# EAGLE design Anode top (EAGLE 5.11)
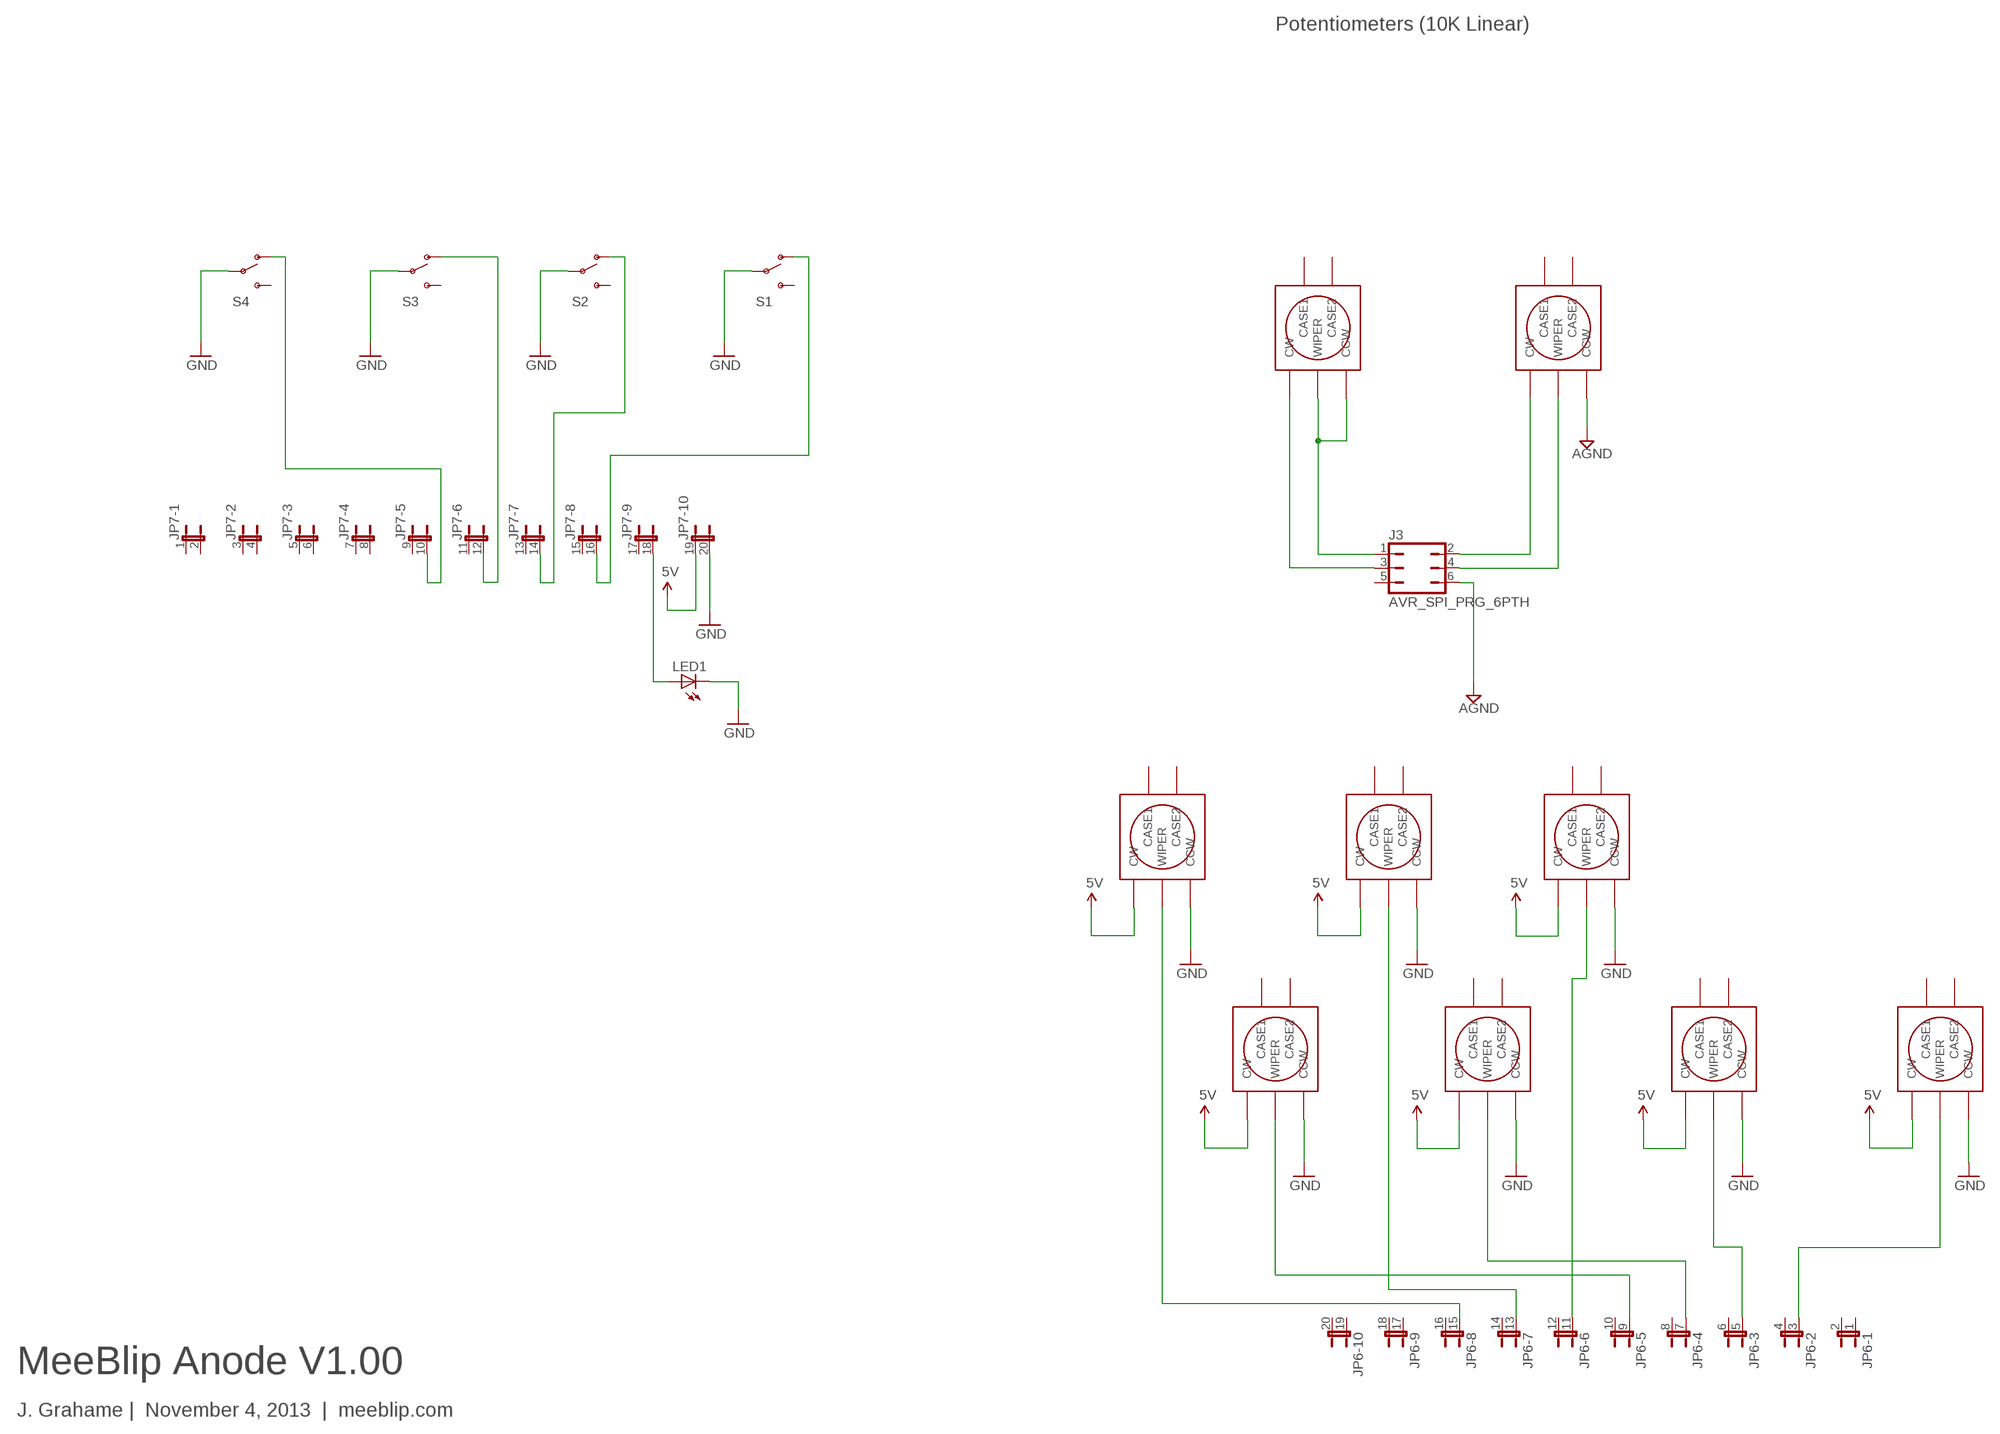
[diagram p0: schematic, sheet 1]

## Parts
J3  AVR_SPI_PRG_6PTH  JP3Q  [JP3Q]
JP6  JP10QE  [JP10Q]
JP7  JP10QE  [JP10Q]
LED1  LED3MM  [LED3MM]
POT1  VACOLOCO_EVUFRK09_POT  [VACOLOCO_EVUF]
POT2  VACOLOCO_EVUFRK09_POT  [VACOLOCO_EVUF]
POT3  VACOLOCO_EVUFRK09_POT  [VACOLOCO_EVUF]
POT4  VACOLOCO_EVUFRK09_POT  [VACOLOCO_EVUF]
POT5  VACOLOCO_EVUFRK09_POT  [VACOLOCO_EVUF]
POT6  VACOLOCO_EVUFRK09_POT  [VACOLOCO_EVUF]
POT7  VACOLOCO_EVUFRK09_POT  [VACOLOCO_EVUF]
POT8  VACOLOCO_EVUFRK09_POT  [VACOLOCO_EVUF]
POT9  VACOLOCO_EVUFRK09_POT  [VACOLOCO_EVUF]
S1  SWITCH-SPSTPTH  [SWITCH-SPDT]
S2  SWITCH-SPSTPTH  [SWITCH-SPDT]
S3  SWITCH-SPSTPTH  [SWITCH-SPDT]
S4  SWITCH-SPSTPTH  [SWITCH-SPDT]

## Nets
5V: JP7.19 POT2.CW POT3.CW POT4.CW POT6.CW POT7.CW POT8.CW POT9.CW
AGND: J3.6 POT1.CCW
GND: JP7.20 LED1.K(C) POT2.CCW POT3.CCW POT4.CCW POT6.CCW POT7.CCW POT8.CCW POT9.CCW S1.2(P) S2.2(P) S3.2(P) S4.2(P)
N$1: J3.2 POT1.CW
N$2: JP7.18 LED1.A
N$3: JP6.15 POT2.WIPER
N$4: JP6.13 POT3.WIPER
N$5: JP7.16 S1.1(O)
N$6: JP7.14 S2.1(O)
N$7: JP6.11 POT4.WIPER
N$8: JP6.9 POT6.WIPER
N$9: JP6.7 POT7.WIPER
N$10: JP7.12 S3.1(O)
N$11: JP7.10 S4.1(O)
N$12: JP6.5 POT8.WIPER
N$13: JP6.3 POT9.WIPER
N$14: J3.4 POT1.WIPER
N$15: J3.1 POT5.CCW POT5.WIPER
N$16: J3.3 POT5.CW
Unconnected: J3.5 JP6.1 JP6.2 JP6.4 JP6.6 JP6.8 JP6.10 JP6.12 JP6.14 JP6.16 JP6.17 JP6.18 JP6.19 JP6.20 JP7.1 JP7.2 JP7.3 JP7.4 JP7.5 JP7.6 JP7.7 JP7.8 JP7.9 JP7.11 JP7.13 JP7.15 JP7.17 POT1.CASE1 POT1.CASE2 POT2.CASE1 POT2.CASE2 POT3.CASE1 POT3.CASE2 POT4.CASE1 POT4.CASE2 POT5.CASE1 POT5.CASE2 POT6.CASE1 POT6.CASE2 POT7.CASE1 POT7.CASE2 POT8.CASE1 POT8.CASE2 POT9.CASE1 POT9.CASE2 S1.3(S) S2.3(S) S3.3(S) S4.3(S)

## Notes on the sheet
- Potentiometers (10K Linear)
- MeeBlip Anode V1.00
- J. Grahame |  November 4, 2013  |  meeblip.com

## Library data of the parts
J3 = jumper:JP3Q: JUMPER
JP6 JP7 = jumper:JP10QE: JUMPER
LED1 = meeblip:LED: LED OSRAM: - CHIPLED LG R971, LG N971, LY N971, LG Q971, LY Q971, LO R971, LY R971 LH N974, LH R974 LS Q976, LO Q976, LY Q976 LO Q996 - Hyper CHIPLED LW Q18S LB Q993, LB Q99A, LB R99A - SideLED LS A670, LO A670, LY A670, LG A670, LP A670 LB A673, LV A673, LT A673, LW A673 LH A674 LY A675 LS A676, LA A676, LO A676, LY A676, LW A676 LS A679, LY A679, LG A679 - Hyper Micro SIDELED® LS Y876, LA Y876, LO Y876, LY Y876 LT Y87S - SmartLED LW L88C, LW L88S LB L89C, LB L89S, LG L890 LS L89K, LO L89K, LY L89K LS L896, LA L896, LO L896, LY L896 - TOPLED LS T670, LO T670, LY T670, LG T670, LP T670 LSG T670, LSP T670, LSY T670, LOP T670, LYG T670 LG T671, LOG T671, LSG T671 LB T673, LV T673, LT T673, LW T673 LH T674 LS T676, LA T676, LO T676, LY T676, LB T676, LH T676, LSB T676, LW T676 LB T67C, LV T67C, LT T67C, LS T67K, LO T67K, LY T67K, LW E67C LS E67B, LA E67B, LO E67B, LY E67B, LB E67C, LV E67C, LT E67C LW T67C LS T679, LY T679, LG T679 LS T770, LO T770, LY T770, LG T770, LP T770 LB T773, LV T773, LT T773, LW T773 LH T774 LS E675, LA E675, LY E675, LS T675 LS T776, LA T776, LO T776, LY T776, LB T776 LHGB T686 LT T68C, LB T68C - Hyper Mini TOPLED® LB M676 - Mini TOPLED Santana® LG M470 LS M47K, LO M47K, LY M47K Source: http://www.osram.convergy.de LUXEON: - LUMILED® LXK2-PW12-R00, LXK2-PW12-S00, LXK2-PW14-U00, LXK2-PW14-V00 LXK2-PM12-R00, LXK2-PM12-S00, LXK2-PM14-U00 LXK2-PE12-Q00, LXK2-PE12-R00, LXK2-PE12-S00, LXK2-PE14-T00, LXK2-PE14-U00 LXK2-PB12-K00, LXK2-PB12-L00, LXK2-PB12-M00, LXK2-PB14-N00, LXK2-PB14-P00, LXK2-PB14-Q00 LXK2-PR12-L00, LXK2-PR12-M00, LXK2-PR14-Q00, LXK2-PR14-R00 LXK2-PD12-Q00, LXK2-PD12-R00, LXK2-PD12-S00 LXK2-PH12-R00, LXK2-PH12-S00 LXK2-PL12-P00, LXK2-PL12-Q00, LXK2-PL12-R00 Source: www.luxeon.com KINGBRIGHT: KA-3528ASYC Source: www.kingbright.com
POT1-POT9 = meeblip-MOD:VACOLOCO_EVUF: Panasonic EVUF type potentionmeter Vertical Mount
S1-S4 = meeblip:SWITCH-SPST: SPDT Switch ON-ON slide switch. Mouser part #102-1221-EV

## Board
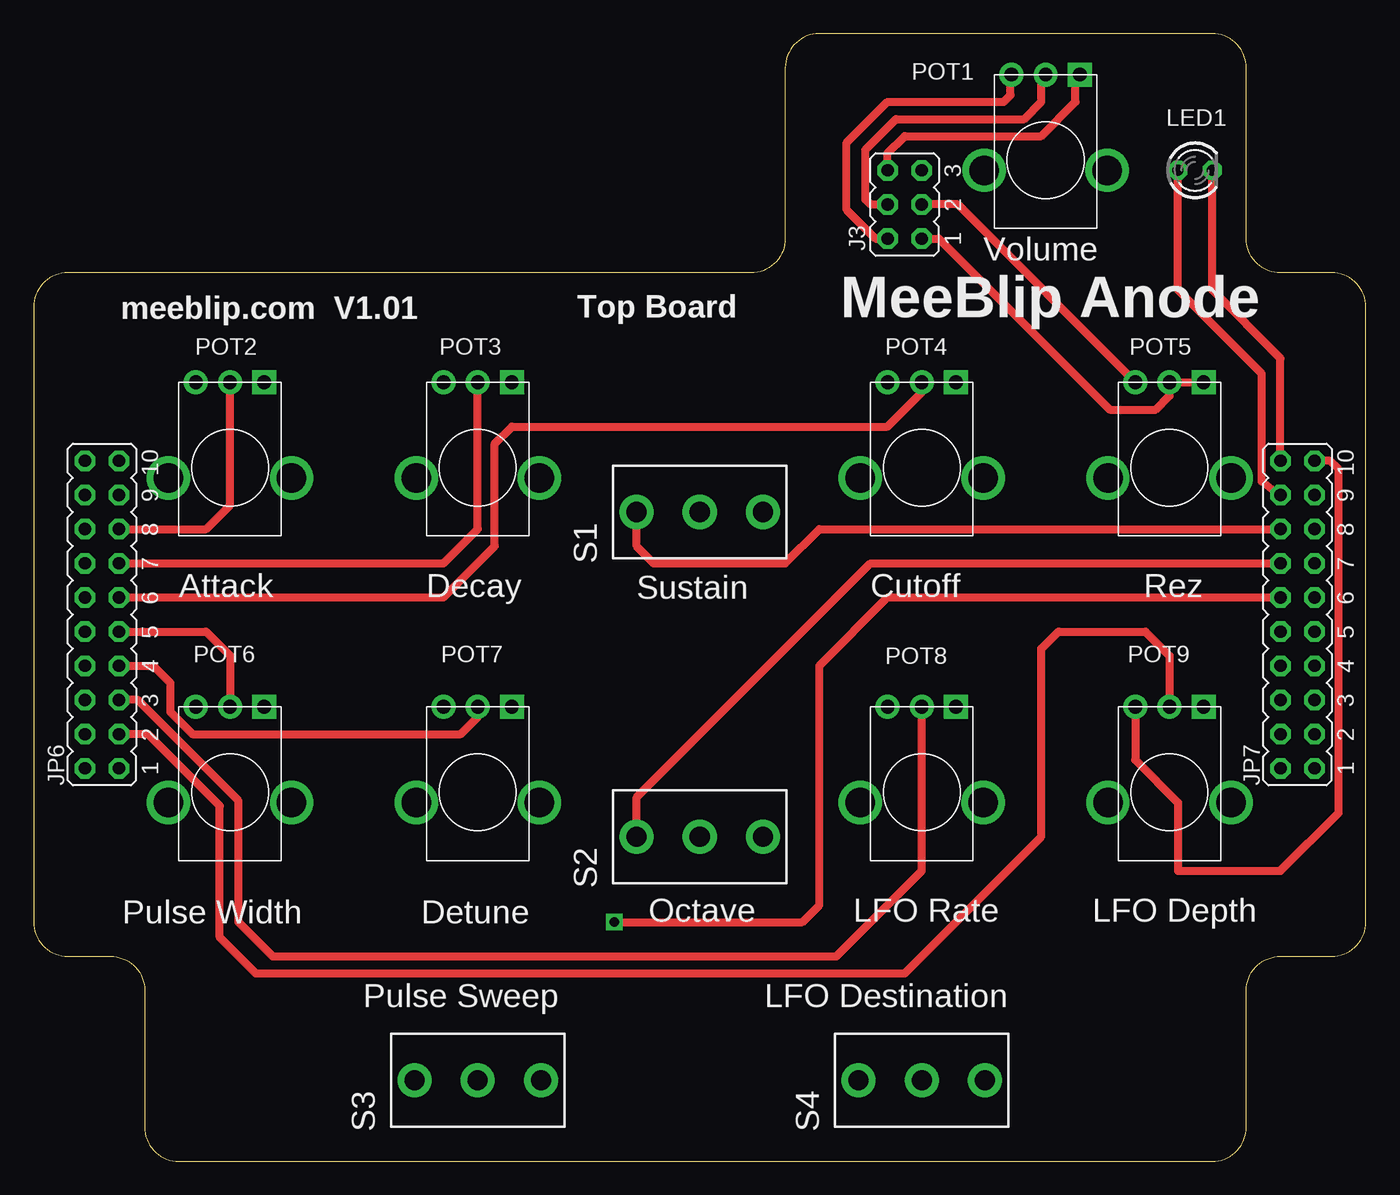
[diagram p1: board, top side]
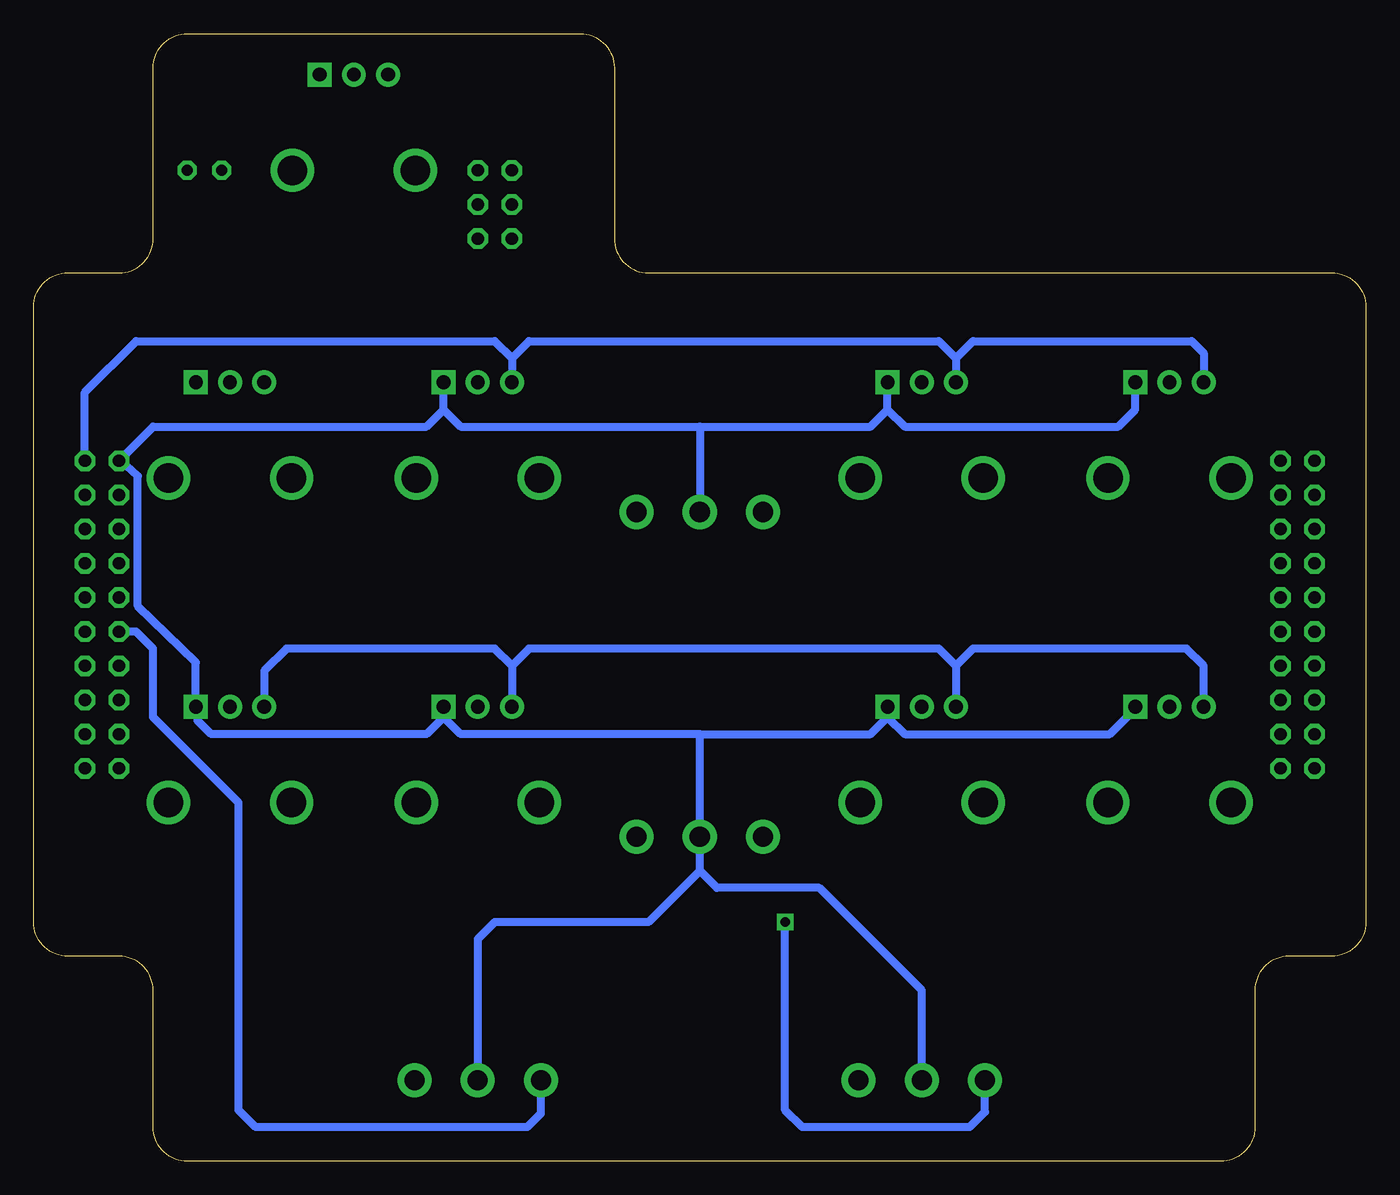
[diagram p2: board, bottom side, seen from below]

Size 99.06 x 83.82 mm. Coordinates in mm from the lower left corner, seen from the top.
Outline: 92.71,66.04 arc-90 90.17,68.58 90.17,81.28 arc90 87.63,83.82 58.42,83.82 arc90 55.88,81.28 55.88,68.58 arc-90 53.34,66.04 2.54,66.04 arc90 0,63.5 0,17.78 arc90 2.54,15.24 5.71,15.24 arc-90 8.26,12.7 8.26,2.54 arc90 10.79,0 87.63,0 arc90 90.17,2.54 90.17,12.7 arc-90 92.71,15.24 96.52,15.24 arc90 99.06,17.78 99.06,63.5 arc90 96.52,66.04 92.71,66.04
Copper layers (1*16): Top 0.035mm / dielectric 1.5mm / Bottom 0.035mm
Design rules "SparkFun": minimum track width 8mil, minimum drill 20mil, track to track 8mil, track to pad 8mil, pad to pad 8mil, via to via 8mil, smd to smd 8mil, copper to edge 10mil, drill to drill 8mil, minimum pad ring 12mil, minimum via ring 10mil, stop-mask expansion 4mil, vias tented up to drill 25mil, thermal gap 10mil

### Footprints (pad centres in the part's own frame; a part is rotated, then mirrored left to right if it is on the bottom)
JP3Q = drill 0.914 octagon: 1 -2.54,-1.27; 2 -2.54,1.27; 3 0,-1.27; 4 0,1.27; 5 2.54,-1.27; 6 2.54,1.27
JP10Q = drill 0.914 octagon: 1 -11.43,-1.27; 2 -11.43,1.27; 3 -8.89,-1.27; 4 -8.89,1.27; 5 -6.35,-1.27; 6 -6.35,1.27; 7 -3.81,-1.27; 8 -3.81,1.27; 9 -1.27,-1.27; 10 -1.27,1.27; 11 1.27,-1.27; 12 1.27,1.27; 13 3.81,-1.27; 14 3.81,1.27; 15 6.35,-1.27; 16 6.35,1.27; 17 8.89,-1.27; 18 8.89,1.27; 19 11.43,-1.27; 20 11.43,1.27
LED3MM = drill 0.813 octagon: A -1.27,0; K 1.27,0
VACOLOCO_EVUF = drill 2.2 round: CASE1 -4.572,0; CASE2 4.572,0 | drill 1.016 pad 1.778 square: CCW -2.54,-7.112 | drill 1.016 pad 1.778 round: CW 2.54,-7.112; WIPER 0,-7.112
SWITCH-SPDT = drill 1.5 pad 2.54 round: 1 0,4.699; 2 0,0; 3 0,-4.699

### Placement (x,y rotation side)
J3  64.77,71.12 90 top
JP6  5.08,40.64 90 top
JP7  93.98,40.64 90 top
LED1  86.36,73.66 0 top
POT1  75.25,73.66 180 top
POT2  14.61,50.8 180 top
POT3  33.02,50.8 180 top
POT4  66.04,50.8 180 top
POT5  84.45,50.8 180 top
POT6  14.61,26.67 180 top
POT7  33.02,26.67 180 top
POT8  66.04,26.67 180 top
POT9  84.45,26.67 180 top
S1  49.53,48.26 90 top
S2  49.53,24.13 90 top
S3  33.02,6.03 90 top
S4  66.04,6.03 90 top

### Tracks (layer width: path | path; a pad name or v marks a point on that pad's centre or on a via)
5V
  Top 0.61: JP7.19 96.39,52.07 97.03,51.44 97.03,25.91 92.71,21.59 85.09,21.59 85.09,26.67 81.92,29.84 POT9.CW
  Bottom 0.61: JP7.19 95.25,57.15 91.44,60.96 64.77,60.96 63.5,59.69 | 63.5,59.69 62.23,60.96 31.75,60.96 30.48,59.69 | 30.48,59.69 29.21,60.96 12.95,60.96 12.06,60.07 POT2.CW | 63.5,36.83 64.77,38.1 80.26,38.1 81.92,36.45 POT9.CW | 30.48,36.83 31.75,38.1 62.23,38.1 63.5,36.83 | 30.48,36.83 29.21,38.1 13.34,38.1 12.06,36.83 POT6.CW | 63.5,59.69 POT4.CW | 30.48,59.69 POT3.CW | 30.48,36.83 POT7.CW | 63.5,36.83 POT8.CW
AGND
  Top 0.406: POT1.CCW 77.47,80.77 77.47,80.45
  Top 0.61: J3.6 63.5,74.93 64.77,76.2 74.93,76.2 77.47,78.74 77.47,80.45
GND
  Top 0.61: LED1.K 87.63,64.77 92.71,59.69 JP7.20
  Bottom 0.61: 68.58,55.88 69.85,54.61 90.17,54.61 JP7.20 92.58,52.07 91.31,50.93 91.31,41.27 87,37.08 POT9.CCW 86.87,33.66 86.87,32.77 85.85,31.75 69.85,31.75 68.58,33.02 | 68.58,55.88 67.31,54.61 49.53,54.61 | 49.53,54.61 36.83,54.61 35.56,55.88 | 35.56,55.88 34.29,54.61 18.41,54.61 17.14,55.88 POT2.CCW | 68.58,33.02 67.31,31.75 49.53,31.75 | 49.53,31.75 36.83,31.75 35.56,33.02 | 35.56,33.02 34.29,31.75 19.05,31.75 17.14,33.66 POT6.CCW | 49.53,54.61 S1.2 | 49.53,31.75 S2.2 49.53,21.59 | 49.53,21.59 48.26,20.32 40.64,20.32 33.02,12.7 S3.2 | 68.58,55.88 POT4.CCW | 35.56,55.88 POT3.CCW | 35.56,33.02 POT7.CCW | 68.58,33.02 POT8.CCW | S4.2 66.04,16.51 64.77,17.78 53.34,17.78 49.53,21.59
N$1
  Top 0.406: POT1.CW 72.64,80.77 72.64,80.71
  Top 0.61: J3.2 62.61,68.58 60.45,70.74 60.45,75.69 63.5,78.74 72.14,78.74 72.64,79.25 72.64,80.71
N$2
  Top 0.61: JP7.18 92.58,49.53 91.31,50.55 91.31,58.55 85.09,64.77 LED1.A
N$3
  Top 0.61: JP6.15 12.83,46.99 14.61,48.77 POT2.WIPER
N$4
  Top 0.61: JP6.13 30.48,44.45 33.02,46.99 POT3.WIPER
N$5
  Top 0.61: JP7.16 58.42,46.99 55.88,44.45 46.1,44.45 44.83,45.72 S1.1
N$6
  Top 0.61: JP7.14 62.23,44.45 44.83,27.05 S2.1
N$7
  Top 0.61: JP6.11 30.48,41.91 34.29,45.72 34.29,53.34 35.56,54.61 63.5,54.61 66.04,57.15 POT4.WIPER
N$8
  Top 0.61: JP6.9 12.83,39.37 14.61,37.59 POT6.WIPER
N$9
  Top 0.61: JP6.7 8.89,36.83 10.16,35.56 10.16,33.4 11.81,31.75 31.75,31.75 33.02,33.02 POT7.WIPER
N$10  (via drill 0.7)
  Top 0.61: JP7.12 63.5,41.91 58.42,36.83 58.42,19.05 57.15,17.78 v43.18,17.78
  Bottom 0.61: v43.18,17.78 43.18,3.81 41.91,2.54 29.46,2.54 28.32,3.68 S3.1
N$11
  Bottom 0.61: JP7.10 91.44,39.37 90.17,38.1 90.17,33.02 83.82,26.67 83.82,3.81 82.55,2.54 62.36,2.54 61.34,3.56 S4.1
N$12
  Top 0.61: JP6.5 7.75,34.29 15.24,26.8 15.24,17.78 17.78,15.24 59.69,15.24 66.04,21.59 POT8.WIPER
N$13
  Top 0.61: JP6.3 8.51,31.75 13.84,26.42 13.84,16.64 16.51,13.97 64.77,13.97 74.93,24.13 74.93,38.1 76.2,39.37 82.68,39.37 84.45,37.59 POT9.WIPER
N$14
  Top 0.406: 74.93,80.45 75.25,80.45 POT1.WIPER
  Top 0.61: 74.93,80.45 74.93,78.74 73.66,77.47 64.14,77.47 61.85,75.18 61.85,71.5 62.23,71.12 J3.4
N$15
  Top 0.61: J3.1 67.31,68.58 80.01,55.88 83.44,55.88 84.45,56.9 POT5.WIPER POT5.CCW
N$16
  Top 0.61: J3.3 68.71,71.12 POT5.CW

### Text on the board
tNames: MeeBlip Anode | Top Board | meeblip.com V1.01
_tNames: Volume | Attack | Decay | Sustain | Cutoff | Rez | Pulse Width | Detune | Octave | LFO Rate | LFO Depth | Pulse Sweep | LFO Destination